# EAGLE schematic sch (EAGLE 8.7.0)
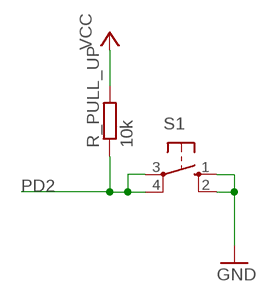
[diagram p0: schematic, sheet 1]

## Parts
R_PULL_UP  10k  R-EU_0207/12  [0207/12]
S1  10-XX  [B3F-10XX]

## Nets
GND: S1.1(S) S1.2(S1)
PD2: R_PULL_UP.1 S1.3(P) S1.4(P1)
VCC: R_PULL_UP.2

## Library data of the parts
R_PULL_UP = rcl:R-EU_: RESISTOR, European symbol; SPICEPREFIX: R
S1 = switch-omron:10-XX: OMRON SWITCH; MPN: B3F-1000; OC_FARNELL: 176432; OC_NEWARK: 36M3542